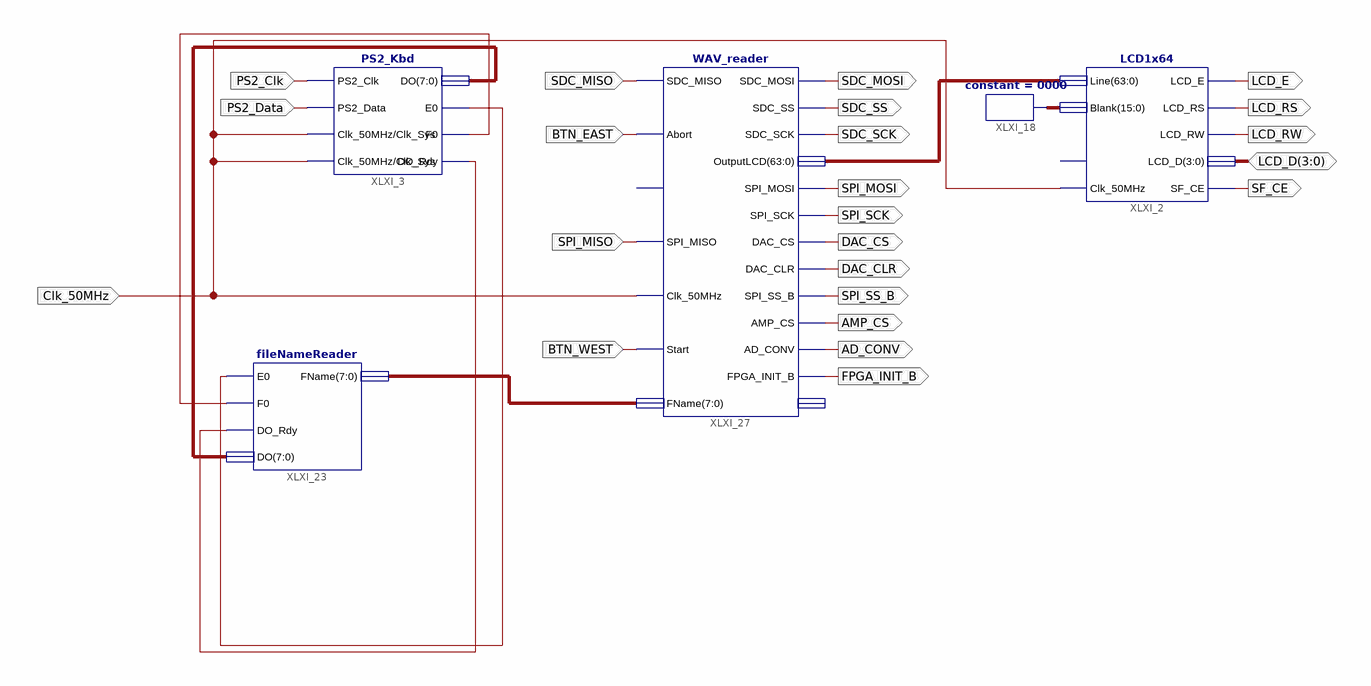
[diagram p0: schematic sheet 1]
// Xilinx ISE schematic schematico.sch (spartan3e) as structural Verilog: 5 symbols, 23 ports
module schematico (
  input  SDC_MISO,
  input  SPI_MISO,
  input  Clk_50MHz,
  input  BTN_WEST,
  input  PS2_Clk,
  input  PS2_Data,
  input  BTN_EAST,
  inout  [3:0] LCD_D,
  output SDC_MOSI,
  output SDC_SS,
  output SDC_SCK,
  output SPI_MOSI,
  output SPI_SCK,
  output DAC_CS,
  output DAC_CLR,
  output SPI_SS_B,
  output AMP_CS,
  output AD_CONV,
  output FPGA_INIT_B,
  output LCD_E,
  output LCD_RS,
  output LCD_RW,
  output SF_CE
);

  wire XLXN_67, XLXN_68, XLXN_69;
  wire [7:0] XLXN_66, XLXN_70;
  wire [15:0] XLXN_50;
  wire [63:0] XLXN_49;

  LCD1x64 XLXI_2 (
    .Clk_50MHz(Clk_50MHz), .Line(XLXN_49), .Blank(XLXN_50), .LCD_D(LCD_D), .LCD_E(LCD_E), .LCD_RW(LCD_RW),
    .LCD_RS(LCD_RS), .SF_CE(SF_CE));  // open: Reset
  PS2_Kbd XLXI_3 (
    .PS2_Clk(PS2_Clk), .PS2_Data(PS2_Data), .Clk_50MHz(Clk_50MHz), .E0(XLXN_69), .F0(XLXN_68),
    .DO_Rdy(XLXN_67), .DO(XLXN_66), .Clk_Sys(Clk_50MHz));
  constant #(.CValue("0000")) XLXI_18 (.O(XLXN_50));
  fileNameReader XLXI_23 (.E0(XLXN_69), .F0(XLXN_68), .DO_Rdy(XLXN_67), .DO(XLXN_66), .FName(XLXN_70));
  WAV_reader XLXI_27 (
    .SDC_MISO(SDC_MISO), .Abort(BTN_EAST), .SPI_MISO(SPI_MISO), .Clk_50MHz(Clk_50MHz), .Start(BTN_WEST),
    .FName(XLXN_70), .SDC_MOSI(SDC_MOSI), .SDC_SS(SDC_SS), .SDC_SCK(SDC_SCK), .OutputLCD(XLXN_49),
    .SPI_MOSI(SPI_MOSI), .SPI_SCK(SPI_SCK), .DAC_CS(DAC_CS), .DAC_CLR(DAC_CLR), .SPI_SS_B(SPI_SS_B),
    .AMP_CS(AMP_CS), .AD_CONV(AD_CONV), .FPGA_INIT_B(FPGA_INIT_B));  // open: Reset, OutputLED
endmodule
